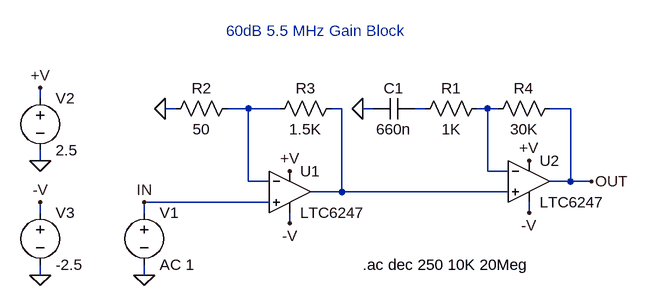
[diagram p0: schematic 6247.asc]
6247.asc, the LTspice schematic file:
Version 4
SHEET 1 2228 1852
WIRE -960 -368 -960 -384
WIRE -752 -352 -768 -352
WIRE -640 -352 -672 -352
WIRE -592 -352 -640 -352
WIRE -496 -352 -512 -352
WIRE -448 -352 -464 -352
WIRE -368 -352 -384 -352
WIRE -272 -352 -288 -352
WIRE -256 -352 -272 -352
WIRE -144 -352 -176 -352
WIRE -960 -272 -960 -288
WIRE -272 -256 -272 -352
WIRE -240 -256 -272 -256
WIRE -640 -240 -640 -352
WIRE -608 -240 -640 -240
WIRE -144 -240 -144 -352
WIRE -144 -240 -176 -240
WIRE -112 -240 -144 -240
WIRE -496 -224 -496 -352
WIRE -496 -224 -544 -224
WIRE -240 -224 -496 -224
WIRE -608 -208 -800 -208
WIRE -960 -192 -960 -208
WIRE -800 -192 -800 -208
WIRE -208 -192 -208 -208
WIRE -576 -176 -576 -192
WIRE -960 -96 -960 -112
WIRE -800 -96 -800 -112
FLAG -800 -96 0
FLAG -576 -256 +V
FLAG -800 -208 IN
FLAG -960 -272 0
FLAG -960 -96 0
FLAG -960 -208 -V
FLAG -768 -352 0
FLAG -464 -352 0
FLAG -112 -240 OUT
FLAG -960 -384 +V
FLAG -576 -176 -V
FLAG -208 -192 -V
FLAG -208 -272 +V
SYMBOL voltage -800 -208 R0
SYMATTR Value AC 1
SYMATTR InstName V1
SYMBOL res -656 -368 R90
WINDOW 0 0 56 VBottom 2
WINDOW 3 32 56 VTop 2
SYMATTR InstName R2
SYMATTR Value 50
SYMBOL res -496 -368 R90
WINDOW 0 0 56 VBottom 2
WINDOW 3 32 56 VTop 2
SYMATTR InstName R3
SYMATTR Value 1.5K
SYMBOL voltage -960 -384 R0
WINDOW 123 24 124 Left 2
WINDOW 39 0 0 Left 2
SYMATTR Value 2.5
SYMATTR InstName V2
SYMBOL voltage -960 -208 R0
WINDOW 123 24 124 Left 2
WINDOW 39 0 0 Left 2
SYMATTR Value -2.5
SYMATTR InstName V3
SYMBOL res -272 -368 R90
WINDOW 0 0 56 VBottom 2
WINDOW 3 32 56 VTop 2
SYMATTR InstName R1
SYMATTR Value 1K
SYMBOL res -160 -368 R90
WINDOW 0 0 56 VBottom 2
WINDOW 3 32 56 VTop 2
SYMATTR InstName R4
SYMATTR Value 30K
SYMBOL cap -384 -368 R90
WINDOW 0 0 32 VBottom 2
WINDOW 3 32 32 VTop 2
SYMATTR InstName C1
SYMATTR Value 660n
SYMBOL Opamps\\LTC6247 -576 -224 R0
SYMATTR InstName U1
SYMBOL Opamps\\LTC6247 -208 -240 R0
SYMATTR InstName U2
TEXT -464 -112 Left 2 !.ac dec 250 10K 20Meg
TEXT -536 -456 Bottom 2 ;60dB 5.5 MHz Gain Block

The netlist it stands for:
* 6247.asc
V1 IN 0 AC 1
R2 N001 0 50
R3 N002 N001 1.5K
V2 +V 0 2.5
V3 -V 0 -2.5
R1 N004 N003 1K
R4 OUT N004 30K
C1 N003 0 660n
* U1: LTC6247 (symbol Opamps\LTC6247 not available, pins judged from their places): In+=IN In-=N001 V+=+V V-=-V OUT=N002
* U2: LTC6247 (symbol Opamps\LTC6247 not available, pins judged from their places): In+=N002 In-=N004 V+=+V V-=-V OUT=OUT
.ac dec 250 10K 20Meg
* 60dB 5.5 MHz Gain Block
.backanno
.end